# Altium schematic sheet ExtPower.SchDoc: External Power
size A; DocumentNumber: 2; SheetNumber: 2; SheetTotal: 22
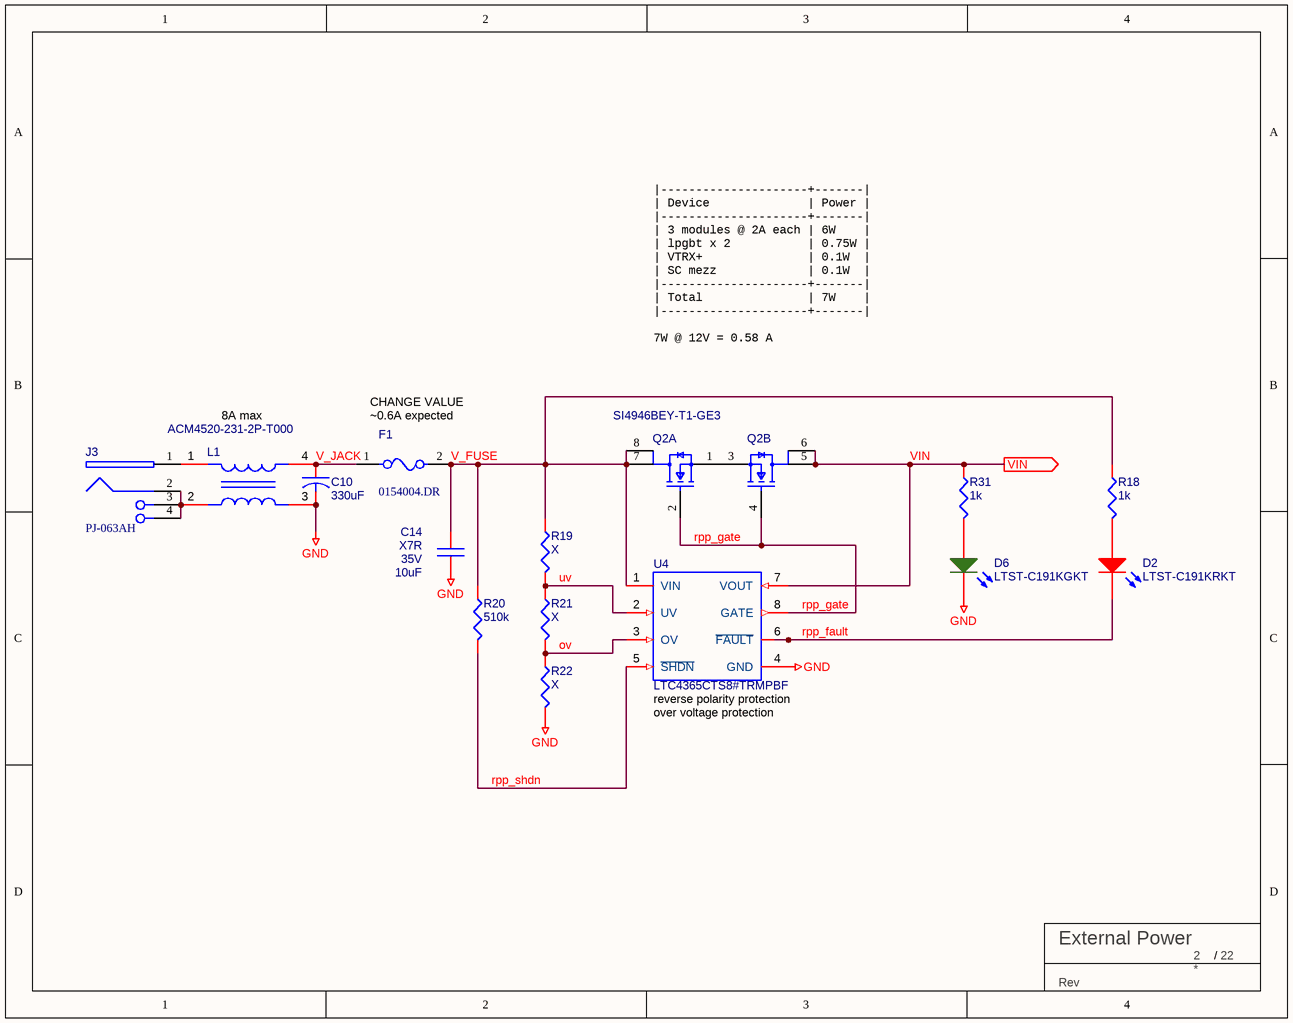
[diagram p0: ExtPower.SchDoc]

## Parts
C10  value 330uF  [venkel0805]  (hidden comment: C0805X7R102-152MNE)
C14  TempCo: X7R  Voltage: 35V  [C_1206_IPC]  (hidden comment: 10uF)
D2  LTST-C191KRKT  [LED_RED]
D6  LTST-C191KGKT  [LED_RED]
F1  0154004.DR  [FP-0154-MFG]
J3  PJ-063AH  [CUI-PJ-063AH_V]
L1  ACM4520-231-2P-T000  [ACM4520-231-2P-T000]
Q2  SI4946BEY-T1-GE3  [FP-C-06527-MFG]  (value not drawn)  (parts A,B of 2)
R18  1k  [R_0402_IPC]
R19  Parameter 1: X  [resc1005n]  (hidden comment: ERJ-2GEJ201X)
R20  Parameter 1: 510k  [resc1005n]  (hidden comment: ERJ-2GEJ201X)
R21  Parameter 1: X  [resc1005n]  (hidden comment: ERJ-2GEJ201X)
R22  Parameter 1: X  [resc1005n]  (hidden comment: ERJ-2GEJ201X)
R31  1k  [R_0402_IPC]
TBLOCK?  BU Title block  (value not drawn)  (graphical)
U4  LTC4365CTS8#TRMPBF  [LT-TS8-8-TSOT-23_V]

## Ports
VIN (out)

## Nets
GND: C10.2 C14.2 D6.2(K) L1.3 R22.2 U4.4(GND)
ov: R21.2 R22.1 U4.3(OV)
rpp_fault: D2.2(K) U4.6(~{FAULT})
rpp_gate: Q2.2(G1) Q2.4(G2) U4.8(GATE)
rpp_shdn: R20.2 U4.5(~{SHDN})
uv: R19.2 R21.1 U4.2(UV)
V_FUSE: C14.1 F1.2 Q2.7(D1) Q2.8(D1) R18.1 R19.1 R20.1 U4.1(VIN)
V_JACK: C10.1 F1.1 L1.4
VIN: Q2.5(D2) Q2.6(D2) R31.1 U4.7(VOUT) ; port VIN
NetD2_1: D2.1(A) R18.2
NetD6_1: D6.1(A) R31.2
NetJ3_1: J3.1 L1.1
NetJ3_2: J3.2 J3.3(SHLD) J3.4(SHLD) L1.2
NetQ2_1: Q2.1(S1) Q2.3(S2)

## Notes on the sheet
- |---------------------+-------|
  | Device              | Power |
  |---------------------+-------|
  | 3 modules @ 2A each | 6W    |
  | lpgbt x 2           | 0.75W |
  | VTRX+               | 0.1W  |
  | SC mezz             | 0.1W  |
  |---------------------+-------|
  | Total               | 7W    |
  |---------------------+-------|
  7W @ 12V = 0.58 A
  7W @ 18V = 0.38 A
- (near L1) 8A max
- CHANGE VALUE
- (near F1) ~0.6A expected
- (near U4) reverse polarity protection
- (near U4) over voltage protection
- (in symbol TITLE_BLOCK_BU) /; Rev

## Library data of the parts
C10 = C: CERAMIC CAPACITOR
C14 = C-CER-E6-10uF-1206-35V-X7R: CAP CER 10UF 35V X7R 1206; Supplier 1: Digi-Key; VALUE: 10uF; Supplier Part Number 1: 587-3007-1-ND
D2 = LED2_RED: Typical RED, GREEN, YELLOW, AMBER GaAs LED; Published: 8-Jun-2000; LatestRevisionDate: 17-Jul-2002; LatestRevisionNote: Re-released for DXP Platform.; PackageVersion: Feb-2002; PackageReference: 3.2X1.6X1.1; Publisher: Altium Limited; PackageDescription: SM LED; 2 Flat Leads
D6 = LED2: Typical RED, GREEN, YELLOW, AMBER GaAs LED; Published: 8-Jun-2000; LatestRevisionDate: 17-Jul-2002; LatestRevisionNote: Re-released for DXP Platform.; PackageVersion: Feb-2002; PackageReference: 3.2X1.6X1.1; Publisher: Altium Limited; PackageDescription: SM LED; 2 Flat Leads
F1 = CMP-08605-000003-1: FUSE BRD MNT 4A 125VAC/VDC 2SMD; Manufacturer: Littelfuse; Fuse Blow Speed: Fast; Max Fuse Ac Voltage: 125V; Lead Free: Yes; Device Class L3: unset; Manufacturer Part Number: 0154004.DR; Device Class L2: Fuses; Package: 0154; ComponentLink2Description: Datasheet; Temperature Range Low: -55°C; Temperature Range High: +125°C; Device Class L1: Circuit Protection; Height: 3.81mm; Temperature: -55°C to +125°C; Mouser Description: Surface Mount Fuses Fuseblock w/ fuse 4A OMNI BLOK 154; Automotive: No; Digikey Description: FUSE BRD MNT 4A 125VAC/VDC 2SMD; RoHS: TRUE; Category: Fuse; Fuse Current: 4A; Max Fuse Dc Voltage: 125V; ComponentLink2URL: https://www.littelfuse.com/~/media/electronics/datasheets/fuses/littelfuse_fuse_154_154t_154l_154tl_datasheet.pdf.pdf; Octopart: https://octopart.com/0154004.dr-littelfuse-565861
J3 = CMP-2000-06898-1: Through Hole Right Angle DC Power Jack, 8 A, 2 mm Center Pin, 2 Position, -25 to 85 degC, RoHS, Bulk; Manufacturer: CUIInc.; Voltage Rating: 24V; Current Rating: 8A; Inside Contact Diameter: 2mm; Insulation Resistance: 100MOhms; Outside Contact Diameter: 6.5mm; Brand: CUI; Termination Style: ThroughHole; Flammability Rating: UL94V-0; Datasheet Version: Rev. 1.02, 03/2016; Manufacturer URL: http://www.cui.com/; Product Category: DCPowerConnectors; Package Description: 2-Pin Through Hole Device, Body 13 x 10 mm, Height 9 mm; Connector Type: DCPowerJack; Factory Pack Quantity: 500; Contact Plating: Nickel; Mounting Style: KinkedPin; Contact Material: Copper; RoHS: True; Mounting Angle: Right; Package Reference: PJ-063AH; Product: Jacks; Contact Gender: Male; Datasheet URL: http://www.cui.com/product/resource/pj-063ah.pdf; Housing Material: PolybutyleneTerephthalate(PBT); Mounting Technology: ThroughHole; Operating Temperature Range: -25Cto+85C
L1 = ACM4520-231-2P-T000: 2 Line Common Mode Choke Surface Mount 230 Ohms @ 100 MHz 3A DCR 50mOhm
Q2 = CMP-02550-000021-1: MOSFET 2N-CH 60V 6.5A 8-SOIC; Manufacturer: Vishay; Number Of N Channels: 2; Turn On Delay Time: 10ns; Gate Charge At Vgs: 17nC @ 10V; Continuous Drain Current: 5.3A; Typ Forward Diode Voltage: 0.8V; Pulse Drain Current: 30A; Max Junction Temp: +175°C; Transconductance: 24S; Depletion Mode: False; Rthja Max: 50°C/W; Standoff Height: 0.1mm; Power Dissipation: 2.4W; Reverse Recovery Charge: 25nC; Input Capacitace At Vds: 840pF @ 30V; Gate To Source Voltage: 20V; Max Forward Diode Voltage: 1.2V; Threshold Vgs Min: 1V; Reverse Recovery Time: 25ns; Drain To Source Resistance: 0.033Ω; Threshold Vgs Max: 3V; Temperature: -55°C to +175°C; Temperature Range Low: -55°C; ComponentLink2URL: http://www.vishay.com/docs/73411/si4946be.pdf; Octopart: https://octopart.com/si4946bey-t1-ge3-vishay-45530440; Temperature Range High: +175°C; Digikey Description: MOSFET 2N-CH 60V 6.5A 8-SOIC; Device Class L2: Transistors; Automotive: No; Drain To Source Voltage: 60V; Manufacturer Part Number: SI4946BEY-T1-GE3; Number Of Channels: 2; Mouser Description: MOSFET 60V 6.5A 3.7W 41mohm @ 10V; ComponentLink2Description: Datasheet; Lead Free: Yes; Device Class L1: Discrete Semiconductors; Category: Trans; Device Class L3: MOSFETs; RoHS: TRUE; Drain To Source Breakdown Voltage: 60V; Height: 1.75mm; Package: C-06527; Turn Off Delay Time: 25ns
R18 R31 = R-E3-1K0-0402-0.5%: RES SMD 1K OHM 0.5% 1/16W 0402; Part Number: RR0510P-102-D
R19-R22 = R1: FILM RESISTOR; Text Field2: 5%
TBLOCK? = TITLE_BLOCK_BU
U4 = LTC4365CTS8: UV, OV and Reverse Supply Protection Controller, 2.5 to 34 V Vin, 8-pin SOT23 (TS8-8), 0 to 70 degC, Pb-Free, Mini Tape and Reel; Manufacturer: Linear Technology; Manufacturer 1: Analog Devices / Linear Technology; Active Limiting: no; Circuit Breakers(#): 1; Fault: yes; Extended Temp: C, I, H; PackageVersion: Rev. A, 08/2010; ComponentLink2URL: http://cds.linear.com/docs/en/datasheet/4365f.pdf; Mounting Technology: Surface Mount; PackageReference: TS8-8; Reset: no; Foldback: no; ComponentLink1URL: http://www.linear.com/; ComponentLink3Description: Package Specification; Power Good: no; ComponentLink3URL: http://cds.linear.com/docs/en/packaging/SOT_8_05-08-1637.pdf; Fast Comparator: no; PackageDescription: 8-Pin Plastic TSOT-23, Body 2.9 x 1.63 mm, Pitch 0.65 mm; Packing: Mini Tape and Reel; PartNumber: LTC4365CTS8#TRMPBF; ComponentLink1Description: Manufacturer URL; ComponentLink2Description: Datasheet; Vin Range: 2.5 to 34 V; Code_JEDEC: MO-193; RoHS: TRUE; Manufacturer Part Number 1: LTC4365CTS8#TRMPBF